# EAGLE design versao3.0 (EAGLE 5.01)
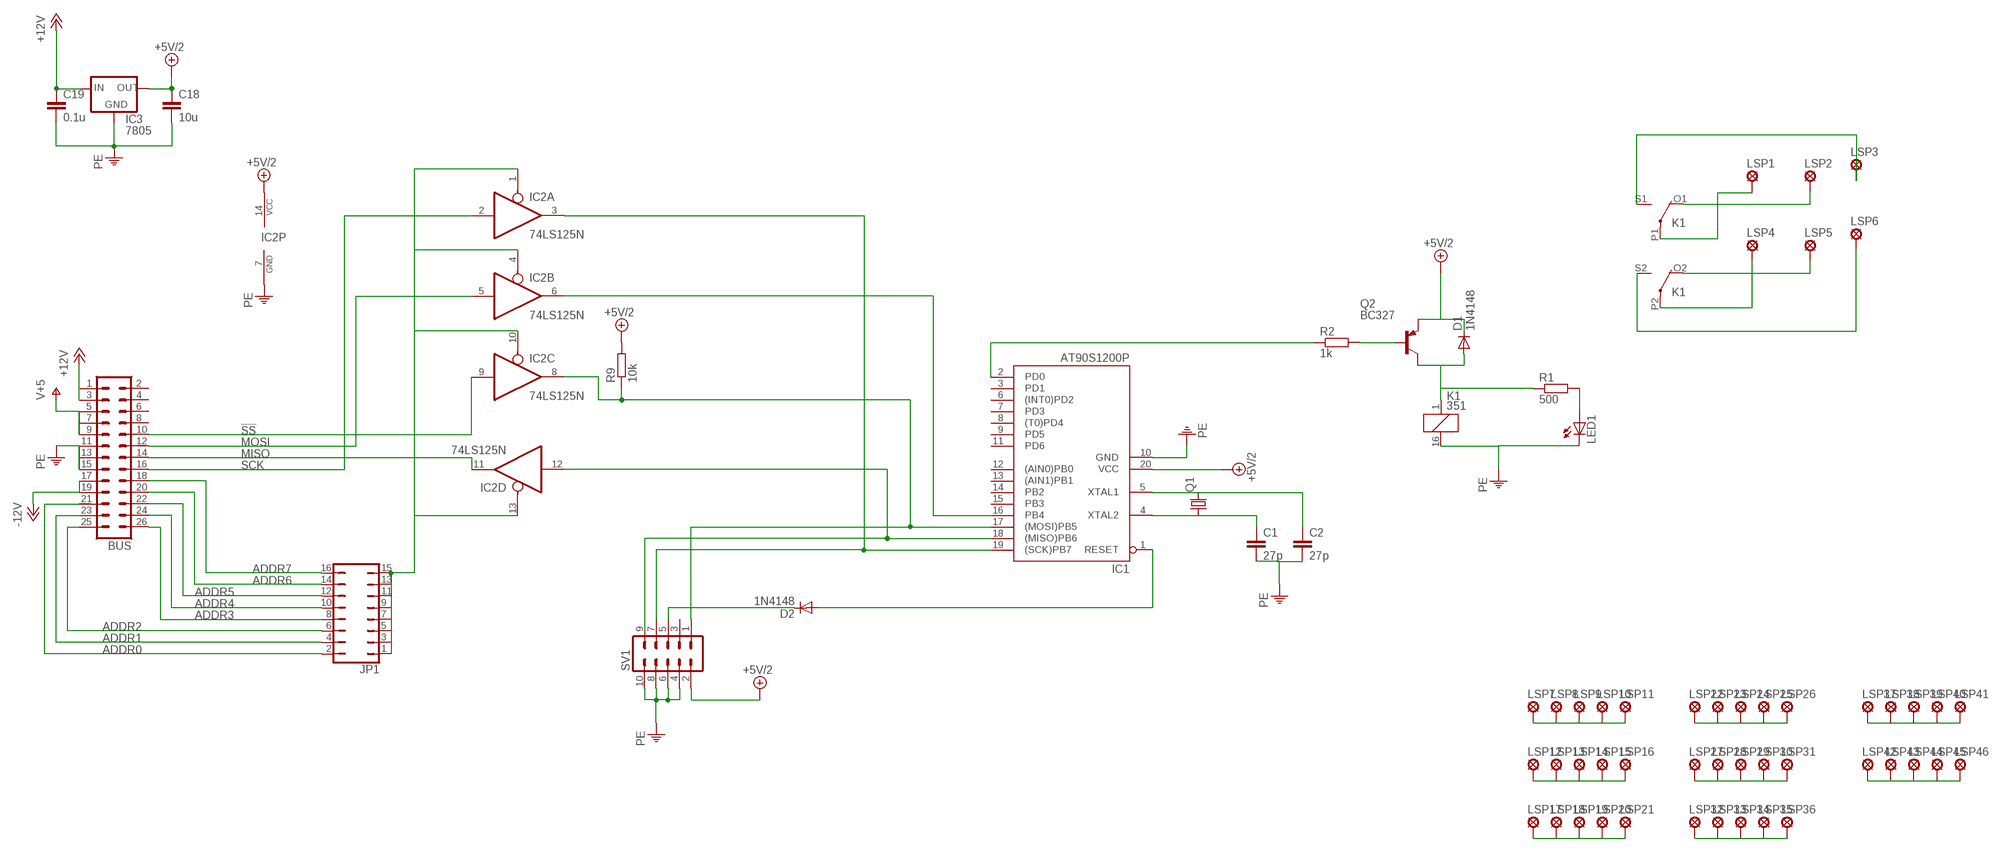
[diagram p0: schematic, sheet 1]

## Parts
BUS  ML26  [ML26]
C1  27p  C5/2.5  [C5B2.5]
C2  27p  C5/2.5  [C5B2.5]
C18  10u  C5/3  [C5B3]
C19  0.1u  C5/3  [C5B3]
D1  1N4148  [DO35-10]
D2  1N4148  [DO35-10]
IC1  AT90S1200P  [DIL20]
IC2  74LS125N  [DIL14]
IC3  7805  78XXL  [78XXL]
JP1  JP8Q  [JP8Q]
K1  351  [351]
LED1  LED3MM  [LED3MM]
LSP1  SE14  [SE14]
LSP2  SE14  [SE14]
LSP3  SE14  [SE14]
LSP4  SE14  [SE14]
LSP5  SE14  [SE14]
LSP6  SE14  [SE14]
LSP7  MCS10B  [MCS10B]
LSP8  MCS10B  [MCS10B]
LSP9  MCS10B  [MCS10B]
LSP10  MCS10B  [MCS10B]
LSP11  MCS10B  [MCS10B]
LSP12  MCS10B  [MCS10B]
LSP13  MCS10B  [MCS10B]
LSP14  MCS10B  [MCS10B]
LSP15  MCS10B  [MCS10B]
LSP16  MCS10B  [MCS10B]
LSP17  MCS10B  [MCS10B]
LSP18  MCS10B  [MCS10B]
LSP19  MCS10B  [MCS10B]
LSP20  MCS10B  [MCS10B]
LSP21  MCS10B  [MCS10B]
LSP22  MCS10B  [MCS10B]
LSP23  MCS10B  [MCS10B]
LSP24  MCS10B  [MCS10B]
LSP25  MCS10B  [MCS10B]
LSP26  MCS10B  [MCS10B]
LSP27  MCS10B  [MCS10B]
LSP28  MCS10B  [MCS10B]
LSP29  MCS10B  [MCS10B]
LSP30  MCS10B  [MCS10B]
LSP31  MCS10B  [MCS10B]
LSP32  MCS10B  [MCS10B]
LSP33  MCS10B  [MCS10B]
LSP34  MCS10B  [MCS10B]
LSP35  MCS10B  [MCS10B]
LSP36  MCS10B  [MCS10B]
LSP37  MCS10B  [MCS10B]
LSP38  MCS10B  [MCS10B]
LSP39  MCS10B  [MCS10B]
LSP40  MCS10B  [MCS10B]
LSP41  MCS10B  [MCS10B]
LSP42  MCS10B  [MCS10B]
LSP43  MCS10B  [MCS10B]
LSP44  MCS10B  [MCS10B]
LSP45  MCS10B  [MCS10B]
LSP46  MCS10B  [MCS10B]
Q1  CRYSTALHC18U-V  [HC18U-V]
Q2  BC327  [TO92-EBC]
R1  500  R-EU_0204/7  [0204/7]
R2  1k  R-EU_0204/7  [0204/7]
R9  10k  R-EU_0204/7  [0204/7]
SV1  ML10  [ML10]

## Nets
!SS: BUS.10 IC2.9(C:I)
+5V/2: C18.1 D1.C IC1.20(VCC) IC2.14(P:VCC) IC3.OUT Q2.E R9.2 SV1.2
+12V: BUS.1 BUS.3 C19.1 IC3.IN
-12V: BUS.17 BUS.19
ADDR0: BUS.21 JP1.2
ADDR1: BUS.23 JP1.4
ADDR2: BUS.25 JP1.6
ADDR3: BUS.26 JP1.8
ADDR4: BUS.24 JP1.10
ADDR5: BUS.22 JP1.12
ADDR6: BUS.20 JP1.14
ADDR7: BUS.18 JP1.16
MISO: BUS.14 IC2.11(D:O)
MOSI: BUS.12 IC2.5(B:I)
N$1: C2.1 IC1.5(XTAL1) Q1.2
N$2: IC1.2(PD0) R2.1
N$3: C1.1 IC1.4(XTAL2) Q1.1
N$4: Q2.B R2.2
N$5: IC1.19((SCK)PB7) IC2.3(A:O) SV1.7
N$6: D1.A K1.1 Q2.C R1.1
N$7: D2.C SV1.5
N$8: LED1.A R1.2
N$9: D2.A IC1.1(RESET)
N$10: K1.P1(2:P) LSP1.MP
N$11: IC1.16(PB4) IC2.6(B:O)
N$12: IC1.18((MISO)PB6) IC2.12(D:I) SV1.9
N$13: IC1.17((MOSI)PB5) IC2.8(C:O) R9.1 SV1.1
N$14: IC2.1(A:OE) IC2.4(B:OE) IC2.10(C:OE) IC2.13(D:OE) JP1.1 JP1.3 JP1.5 JP1.7 JP1.9 JP1.11 JP1.13 JP1.15
N$15: K1.P2(3:P) LSP4.MP
N$16: K1.O1(2:O) LSP2.MP
N$17: K1.O2(3:O) LSP5.MP
N$18: K1.S1(2:S) LSP3.MP
N$19: K1.S2(3:S) LSP6.MP
N$20: LSP7.MP LSP8.MP LSP9.MP LSP10.MP LSP11.MP
N$21: LSP12.MP LSP13.MP LSP14.MP LSP15.MP LSP16.MP
N$22: LSP17.MP LSP18.MP LSP19.MP LSP20.MP LSP21.MP
N$23: LSP22.MP LSP23.MP LSP24.MP LSP25.MP LSP26.MP
N$24: LSP27.MP LSP28.MP LSP29.MP LSP30.MP LSP31.MP
N$25: LSP32.MP LSP33.MP LSP34.MP LSP35.MP LSP36.MP
N$27: LSP37.MP LSP38.MP LSP39.MP LSP40.MP LSP41.MP
N$28: LSP42.MP LSP43.MP LSP44.MP LSP45.MP LSP46.MP
PE: BUS.11 BUS.13 BUS.15 C1.2 C2.2 C18.2 C19.2 IC1.10(GND) IC2.7(P:GND) IC3.GND K1.16 LED1.K(C) SV1.4 SV1.6 SV1.8 SV1.10
SCK: BUS.16 IC2.2(A:I)
V+: BUS.5 BUS.7 BUS.9 ; supply symbol labelled V+5
Unconnected: BUS.2 BUS.4 BUS.6 BUS.8 IC1.3(PD1) IC1.6((INT0)PD2) IC1.7(PD3) IC1.8((T0)PD4) IC1.9(PD5) IC1.11(PD6) IC1.12((AIN0)PB0) IC1.13((AIN1)PB1) IC1.14(PB2) IC1.15(PB3) SV1.3

## Library data of the parts
BUS = con-harting-ml:ML26: HARTING
C1 C2 C18 C19 = capacitor-wima:C: CAPACITOR naming: grid - package width
D1 D2 = diode:1N4148: DIODE high speed (Philips)
IC1 = atmel:AT90S1200: MICROCONTROLLER 1 Kbytes FLASH 64 bytes EEPROM; OC_FARNELL: unknown; OC_NEWARK: unknown
IC2 = 74xx-us:74*125: Quad bus BUFFER, 3-state
IC3 = v-reg:78XXL: VOLTAGE REGULATOR
JP1 = jumper:JP8Q: JUMPER
K1 = relay:351: RELAY 2 x switch, Omron
LED1 = led:LED: LED OSRAM: - CHIPLED LG R971, LG N971, LY N971, LG Q971, LY Q971, LO R971, LY R971 LH N974, LH R974 LS Q976, LO Q976, LY Q976 LO Q996 - Hyper CHIPLED LW Q18S LB Q993, LB Q99A, LB R99A - SideLED LS A670, LO A670, LY A670, LG A670, LP A670 LB A673, LV A673, LT A673, LW A673 LH A674 LY A675 LS A676, LA A676, LO A676, LY A676, LW A676 LS A679, LY A679, LG A679 - Hyper Micro SIDELED® LS Y876, LA Y876, LO Y876, LY Y876 LT Y87S - SmartLED LW L88C, LW L88S LB L89C, LB L89S, LG L890 LS L89K, LO L89K, LY L89K LS L896, LA L896, LO L896, LY L896 - TOPLED LS T670, LO T670, LY T670, LG T670, LP T670 LSG T670, LSP T670, LSY T670, LOP T670, LYG T670 LG T671, LOG T671, LSG T671 LB T673, LV T673, LT T673, LW T673 LH T674 LS T676, LA T676, LO T676, LY T676, LB T676, LH T676, LSB T676, LW T676 LB T67C, LV T67C, LT T67C, LS T67K, LO T67K, LY T67K, LW E67C LS E67B, LA E67B, LO E67B, LY E67B, LB E67C, LV E67C, LT E67C LW T67C LS T679, LY T679, LG T679 LS T770, LO T770, LY T770, LG T770, LP T770 LB T773, LV T773, LT T773, LW T773 LH T774 LS E675, LA E675, LY E675, LS T675 LS T776, LA T776, LO T776, LY T776, LB T776 LHGB T686 LT T68C, LB T68C - Hyper Mini TOPLED® LB M676 - Mini TOPLED Santana® LG M470 LS M47K, LO M47K, LY M47K Source: http://www.osram.convergy.de - LUMILED® LXK2-PW12-R00, LXK2-PW12-S00, LXK2-PW14-U00, LXK2-PW14-V00 LXK2-PM12-R00, LXK2-PM12-S00, LXK2-PM14-U00 LXK2-PE12-Q00, LXK2-PE12-R00, LXK2-PE12-S00, LXK2-PE14-T00, LXK2-PE14-U00 LXK2-PB12-K00, LXK2-PB12-L00, LXK2-PB12-M00, LXK2-PB14-N00, LXK2-PB14-P00, LXK2-PB14-Q00 LXK2-PR12-L00, LXK2-PR12-M00, LXK2-PR14-Q00, LXK2-PR14-R00 LXK2-PD12-Q00, LXK2-PD12-R00, LXK2-PD12-S00 LXK2-PH12-R00, LXK2-PH12-S00 LXK2-PL12-P00, LXK2-PL12-Q00, LXK2-PL12-R00 Source: www.luxeon.com
LSP1-LSP6 = solpad:SE14: SOLDER PAD E1553, drill 1,4mm, distributor Buerklin, 07F820
LSP7-LSP46 = solpad:MCS10B: SOLDER PAD MC S1, distributor Buerklin, 15F505
Q1 = crystal:CRYSTAL: CRYSTAL
Q2 = transistor-pnp:BC327*: PNP Transistror
R1 R2 R9 = resistor:R-EU_: RESISTOR, European symbol
SV1 = con-ml:ML10: HARTING

## Board
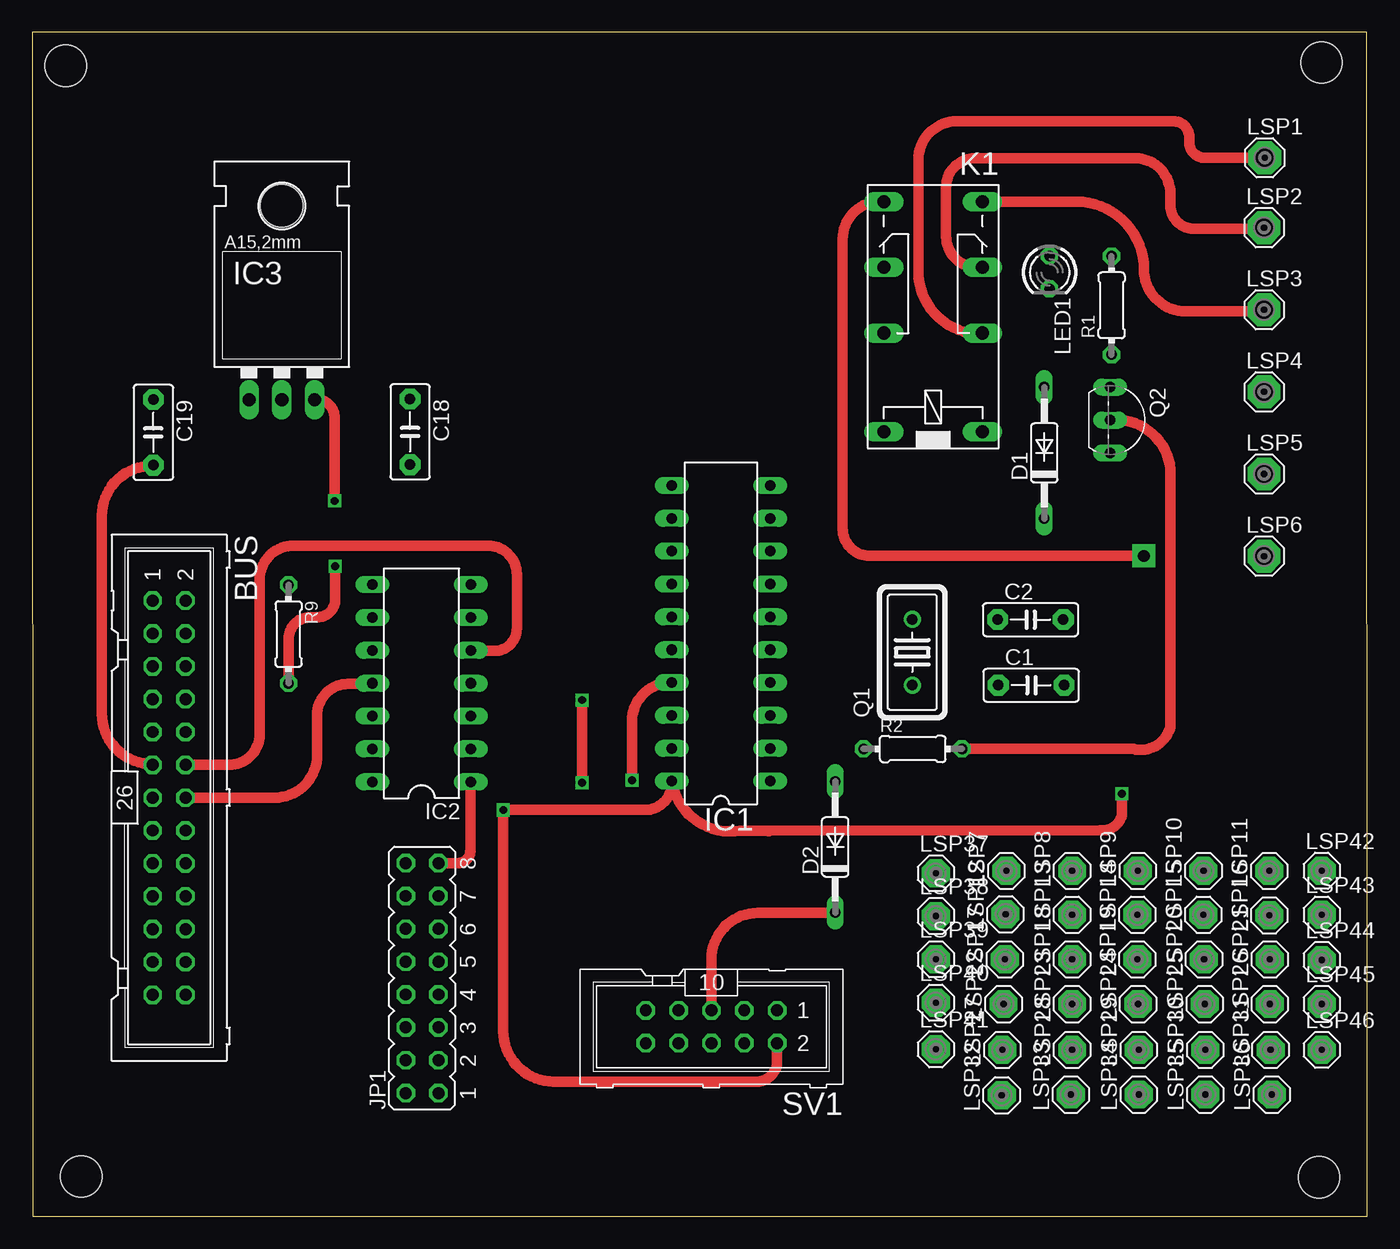
[diagram p1: board, top side]
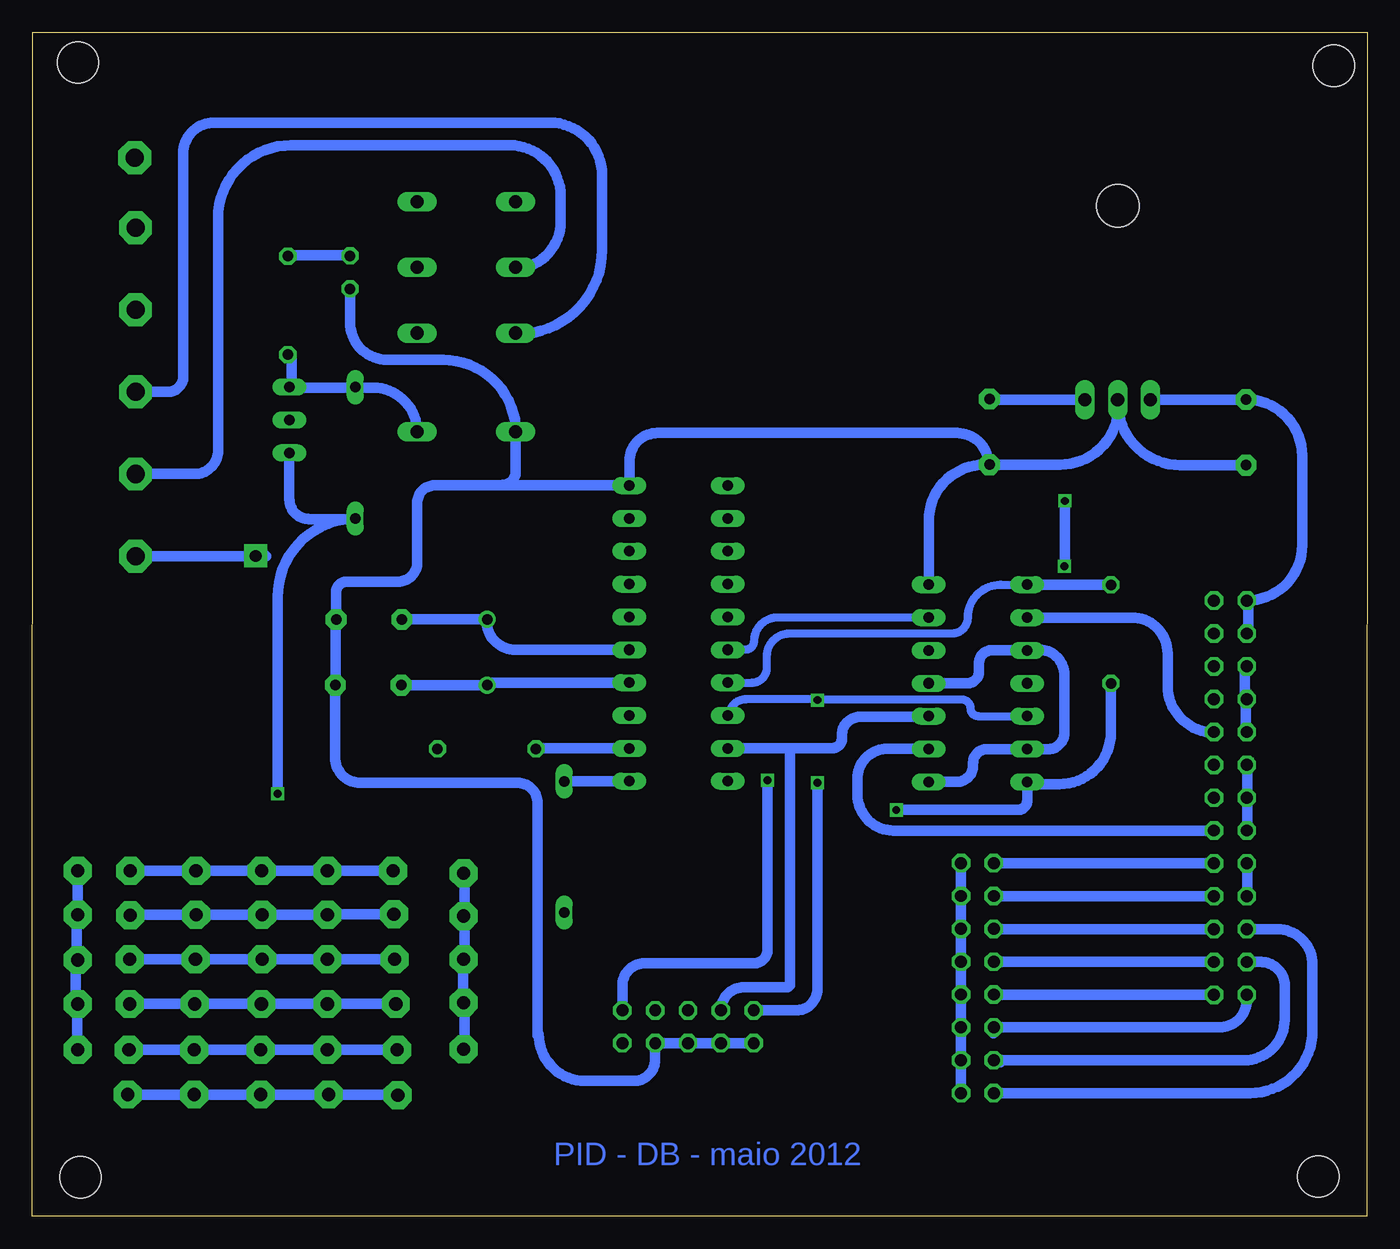
[diagram p2: board, bottom side, seen from below]

Size 103.25 x 91.55 mm. Coordinates in mm from the lower left corner, seen from the top.
Outline: 0.05,0 103.25,0 103.2,91.55 0,91.55 0.05,0
Copper layers (1*16): Top 0.035mm / dielectric 1.5mm / Bottom 0.035mm
Design rules "default": minimum track width 10mil, minimum drill 24mil, track to track 8mil, track to pad 8mil, pad to pad 8mil, via to via 8mil, smd to smd 8mil, copper to edge 40mil, drill to drill 8mil, minimum pad ring 10mil, minimum via ring 8mil, stop-mask expansion 4mil, vias tented up to drill 0mil, thermal gap 10mil
Holes 3.2 mm at 2.58,88.97 3.78,3.07 99.73,89.22 99.53,3.02

### Footprints (pad centres in the part's own frame; a part is rotated, then mirrored left to right if it is on the bottom)
ML26 = drill 0.914 octagon: 1 -15.24,-1.27; 2 -15.24,1.27; 3 -12.7,-1.27; 4 -12.7,1.27; 5 -10.16,-1.27; 6 -10.16,1.27; 7 -7.62,-1.27; 8 -7.62,1.27; 9 -5.08,-1.27; 10 -5.08,1.27; 11 -2.54,-1.27; 12 -2.54,1.27; 13 0,-1.27; 14 0,1.27; 15 2.54,-1.27; 16 2.54,1.27; 17 5.08,-1.27; 18 5.08,1.27; 19 7.62,-1.27; 20 7.62,1.27; 21 10.16,-1.27; 22 10.16,1.27; 23 12.7,-1.27; 24 12.7,1.27; 25 15.24,-1.27; 26 15.24,1.27
C5B2.5 = drill 0.813 pad 1.6 octagon: 1 -2.54,0; 2 2.54,0
C5B3 = drill 0.813 pad 1.6 octagon: 1 -2.54,0; 2 2.54,0
DO35-10 = drill 0.813 long: A 5.08,0; C -5.08,0
DIL20 = drill 0.813 long: 1 -11.43,-3.81; 2 -8.89,-3.81; 3 -6.35,-3.81; 4 -3.81,-3.81; 5 -1.27,-3.81; 6 1.27,-3.81; 7 3.81,-3.81; 8 6.35,-3.81; 9 8.89,-3.81; 10 11.43,-3.81; 11 11.43,3.81; 12 8.89,3.81; 13 6.35,3.81; 14 3.81,3.81; 15 1.27,3.81; 16 -1.27,3.81; 17 -3.81,3.81; 18 -6.35,3.81; 19 -8.89,3.81; 20 -11.43,3.81
DIL14 = drill 0.813 long: 1 -7.62,-3.81; 2 -5.08,-3.81; 3 -2.54,-3.81; 4 0,-3.81; 5 2.54,-3.81; 6 5.08,-3.81; 7 7.62,-3.81; 8 7.62,3.81; 9 5.08,3.81; 10 2.54,3.81; 11 0,3.81; 12 -2.54,3.81; 13 -5.08,3.81; 14 -7.62,3.81
78XXL = drill 1.016 long: GND 0,-3.81; IN -2.54,-3.81; OUT 2.54,-3.81 | hole 3.302: 0,11.176
JP8Q = drill 0.914 octagon: 1 -8.89,-1.27; 2 -8.89,1.27; 3 -6.35,-1.27; 4 -6.35,1.27; 5 -3.81,-1.27; 6 -3.81,1.27; 7 -1.27,-1.27; 8 -1.27,1.27; 9 1.27,-1.27; 10 1.27,1.27; 11 3.81,-1.27; 12 3.81,1.27; 13 6.35,-1.27; 14 6.35,1.27; 15 8.89,-1.27; 16 8.89,1.27
351 = drill 1.016 long: 1 -3.81,-3.81; 16 -3.81,3.81; O1 8.89,-3.81; O2 8.89,3.81; P1 3.81,-3.81; P2 3.81,3.81; S1 13.97,-3.81; S2 13.97,3.81
LED3MM = drill 0.813 octagon: A -1.27,0; K 1.27,0
SE14 = drill 1.397 pad 2.54 octagon: MP 0,0
MCS10B = drill 1.016 pad 2.159 octagon: MP 0,0
HC18U-V = drill 0.813 round: 1 -2.54,0; 2 2.54,0
TO92-EBC = drill 0.813 long: B 0,-1.27; C -2.54,-1.27; E 2.54,-1.27
0204/7 = drill 0.813 octagon: 1 -3.81,0; 2 3.81,0
ML10 = drill 0.914 octagon: 1 -5.08,-1.27; 2 -5.08,1.27; 3 -2.54,-1.27; 4 -2.54,1.27; 5 0,-1.27; 6 0,1.27; 7 2.54,-1.27; 8 2.54,1.27; 9 5.08,-1.27; 10 5.08,1.27

### Placement (x,y rotation side)
BUS  10.58,32.37 270 top
C1  77.26,41.07 0 top
C2  77.21,46.14 0 top
C18  29.22,60.66 270 top
C19  9.36,60.62 270 top
D1  78.28,59.03 90 top
D2  62.11,28.56 90 top
IC1  53.26,45.08 90 top
IC2  30.1,41.22 90 top
IC3  19.3,66.95 0 top
JP1  30.15,18.42 90 top
K1  69.68,64.49 90 top
LED1  78.68,72.99 270 top
LSP1  95.32,81.85 0 top
LSP2  95.27,76.45 0 top
LSP3  95.27,70.1 0 top
LSP4  95.27,63.75 0 top
LSP5  95.27,57.4 0 top
LSP6  95.27,51.05 0 top
LSP7  75.35,26.71 90 top
LSP8  80.43,26.71 90 top
LSP9  85.51,26.71 90 top
LSP10  90.59,26.71 90 top
LSP11  95.67,26.71 90 top
LSP12  75.28,23.37 90 top
LSP13  80.43,23.32 90 top
LSP14  85.48,23.32 90 top
LSP15  90.58,23.32 90 top
LSP16  95.68,23.27 90 top
LSP17  75.23,19.87 90 top
LSP18  80.43,19.87 90 top
LSP19  85.48,19.87 90 top
LSP20  90.63,19.87 90 top
LSP21  95.73,19.87 90 top
LSP22  75.13,16.42 90 top
LSP23  80.43,16.42 90 top
LSP24  85.53,16.42 90 top
LSP25  90.68,16.42 90 top
LSP26  95.73,16.42 90 top
LSP27  75.03,12.87 90 top
LSP28  80.43,12.87 90 top
LSP29  85.58,12.87 90 top
LSP30  90.73,12.87 90 top
LSP31  95.78,12.87 90 top
LSP32  74.98,9.37 90 top
LSP33  80.33,9.42 90 top
LSP34  85.58,9.42 90 top
LSP35  90.73,9.42 90 top
LSP36  95.88,9.42 90 top
LSP37  69.88,26.52 0 top
LSP38  69.88,23.22 0 top
LSP39  69.88,19.87 0 top
LSP40  69.88,16.52 0 top
LSP41  69.88,12.92 0 top
LSP42  99.73,26.72 0 top
LSP43  99.73,23.32 0 top
LSP44  99.73,19.82 0 top
LSP45  99.73,16.42 0 top
LSP46  99.73,12.87 0 top
Q1  68.06,43.62 90 top
Q2  84.64,61.57 270 top
R1  83.48,70.44 90 top
R2  68.1,36.14 0 top
R9  19.82,45.02 270 top
SV1  52.53,14.66 180 top

### Tracks (layer width: path | path; a pad name or v marks a point on that pad's centre or on a via)
!SS
  Bottom 0.813: IC2.9 18.21,46.3 arc90 15.43,43.52 15.43,41.02 arc-90 11.83,37.42 arc90 BUS.10
+5V/2  (via drill 0.6)
  Top 0.813: R9.2 arc90 R9.2 19.83,44.67 arc-90 21.48,46.32 22.03,46.32 arc90 23.43,47.72 v23.43,50.27 | IC3.OUT 21.95,63.14 arc90 21.98,63.17 arc-90 23.38,61.77 v23.38,55.32 | SV1.2 57.61,12 arc-90 56.03,10.42 40.33,10.42 arc-90 36.43,14.32 36.43,31.32 arc-90 36.48,31.37 arc-90 v36.43,31.42 47.38,31.42 arc90 49.48,33.52 arc-90 49.45,33.55 IC1.20 arc90 54.73,29.82 56.88,29.82 arc90 57.03,29.82 82.63,29.87 arc90 84.28,31.12 v84.28,32.67
  Bottom 0.813: C18.1 29.11,63.2 arc90 29.08,63.17 arc-90 29.05,63.14 IC3.OUT | R9.2 19.82,37.43 arc90 23.83,33.42 25.93,33.42 arc90 26.23,33.72 arc-90 26.29,33.66 IC2.14 26.29,32.16 arc90 27.03,31.42 v36.43,31.42 | v23.43,50.27 arc-90 23.38,50.32 v23.38,55.32 | Q2.E 83.37,55.46 arc-90 81.83,53.92 78.48,53.92 arc90 78.43,53.87 arc90 78.35,53.95 D1.C 78.2,53.95 arc-90 78.18,53.97 arc-90 84.28,47.87 v84.28,32.67
+12V
  Bottom 0.813: 9.18,47.61 9.18,47.67 | 9.18,47.61 BUS.1 arc-90 5.03,51.89 5.03,58.82 arc-90 9.38,63.17 arc-90 C19.1 16.59,63.16 arc-90 16.73,63.02 arc90 16.76,63.05 IC3.IN | BUS.3 9.18,45.07 9.18,47.61
-12V
  Bottom 0.813: BUS.17 9.28,27.29 9.28,24.75 BUS.19
ADDR0
  Bottom 0.813: BUS.21 6.97,22.21 arc90 4.23,19.47 4.23,14.37 arc90 9.08,9.52 28.78,9.52 arc-90 28.83,9.47 arc90 JP1.2
ADDR1
  Bottom 0.813: BUS.23 8.23,19.67 arc90 6.38,17.82 6.38,15.22 arc90 9.53,12.07 28.23,12.07 arc-90 28.38,11.92 28.93,11.92 arc-90 28.88,11.97 JP1.4
ADDR2
  Bottom 0.813: BUS.25 9.31,16.74 arc90 11.43,14.62 28.48,14.62 arc-90 28.93,14.17 arc-90 28.88,14.22 JP1.6
ADDR3
  Bottom 0.813: JP1.8 28.8,17.15 arc-90 28.78,17.17 arc-90 28.74,17.13 BUS.26
ADDR4
  Bottom 0.813: JP1.10 28.61,19.69 arc-90 28.53,19.77 arc-90 28.43,19.67 BUS.24
ADDR5
  Bottom 0.813: JP1.12 28.82,22.23 arc-90 28.78,22.27 arc-90 28.72,22.21 BUS.22
ADDR6
  Bottom 0.813: BUS.20 28.86,24.75 arc90 JP1.14
ADDR7
  Bottom 0.813: JP1.16 JP1.16 arc-90 28.85,27.29 BUS.18
MISO
  Top 0.813: BUS.14 18.73,32.37 arc90 22.03,35.67 22.03,38.77 arc-90 24.43,41.17 26.23,41.17 arc90 26.33,41.27 arc90 IC2.11
MOSI
  Top 0.813: BUS.12 15.22,34.91 arc90 17.58,37.27 17.58,49.22 arc-90 20.23,51.87 35.23,51.87 arc-90 37.48,49.62 37.48,45.47 arc-90 35.73,43.72 34.03,43.72 arc-90 33.98,43.77 arc-90 33.97,43.76 IC2.5
N$1
  Bottom 0.813: IC1.5 65.87,43.81 arc90 68.13,46.07 arc-90 68.06,46.14 Q1.2 74.72,46.16 arc90 74.73,46.17 arc-90 74.7,46.14 C2.1
N$2
  Bottom 0.813: R2.1 64.29,36.11 arc90 64.38,36.02 arc90 64.21,36.19 IC1.2
N$3
  Bottom 0.813: IC1.4 67.93,41.27 arc-90 68.08,41.12 arc90 68.06,41.1 Q1.1 67.97,41.08 arc-90 67.93,41.12 arc90 67.98,41.07 C1.1
N$4
  Top 0.813: R2.2 85.15,36.14 arc90 88.03,37.87 88.03,57.77 arc90 Q2.B
N$5
  Bottom 0.813: 44.63,36.19 41.41,36.19 arc-90 40.63,36.97 40.63,37.22 arc90 39.23,38.62 33.83,38.62 arc-90 33.78,38.67 arc-90 33.79,38.68 IC2.3 | 44.63,36.19 IC1.19 | SV1.7 arc90 48.2,17.72 44.93,17.72 arc-90 44.63,18.02 44.63,36.19
N$6
  Bottom 0.813: 78.32,64.07 78.38,64.07 | 78.32,64.07 arc-90 D1.A arc90 78.32,64.07 | K1.1 arc-90 76.88,64.07 78.32,64.07 | 78.32,64.07 83.33,64.07 arc90 Q2.C arc90 Q2.C 83.18,64.12 83.18,66.33 arc-90 R1.1
N$7
  Top 0.813: SV1.5 52.53,19.87 arc-90 56.13,23.47 62.03,23.47 arc-90 62.18,23.32 arc-90 62.11,23.39 D2.C
N$8
  Bottom 0.813: LED1.A arc-90 78.63,74.31 78.63,74.32 83.41,74.32 arc-90 R1.2
N$9
  Bottom 0.813: IC1.1 57.2,33.65 arc-90 57.28,33.57 arc-90 57.35,33.64 D2.A
N$10
  Top 0.813: LSP1.MP 90.7,81.85 arc-90 89.48,83.07 89.48,83.47 arc90 88.28,84.67 71.53,84.67 arc90 68.53,81.67 68.53,73.07 arc90 73.38,68.22 arc-90 73.46,68.3 K1.P1
N$11
  Bottom 0.61: IC2.6 45.6,46.3 arc-90 47.43,44.47 arc90 48.08,43.82 IC1.16 | IC1.16 49.53,43.82 | IC1.16 arc90 IC1.16
N$12  (via drill 0.6)
  Top 0.813: v42.53,33.52 v42.53,39.92
  Bottom 0.61: IC2.12 30.09,38.68 arc90 30.68,39.27 arc-90 31.38,39.97 42.53,39.97 48.08,39.97 arc-90 49.38,38.67 arc-90 IC1.18
  Bottom 0.813: SV1.9 44.17,15.93 arc-90 42.53,17.57 v42.53,33.52 | 42.53,39.97 v42.53,39.92 42.53,39.87
N$13  (via drill 0.6)
  Top 0.813: IC1.17 49.38,41.27 arc90 46.38,38.27 v46.38,33.72
  Bottom 0.61: IC2.8 28.36,48.84 arc-90 30.88,46.32 arc90 32.13,45.07 44.68,45.07 arc-90 46.43,43.32 46.43,42.42 arc90 47.58,41.27 IC1.17 49.48,41.27
  Bottom 0.813: R9.1 19.82,48.78 arc90 19.88,48.72 arc-90 20,48.84 IC2.8 | SV1.1 57.61,17.84 arc90 55.88,19.57 47.43,19.57 arc-90 46.38,20.62 v46.38,33.72
N$14
  Top 0.813: JP1.15 32.92,27.31 arc90 33.88,28.27 33.88,33.42 arc-90 33.98,33.52 arc-90 IC2.1
  Bottom 0.813: IC2.4 30.93,41.22 arc-90 30.03,42.12 30.03,42.77 arc90 29.03,43.77 26.38,43.77 arc90 26.33,43.72 arc-90 IC2.10 arc90 26.23,43.82 25.38,43.82 arc90 23.43,41.87 23.43,37.37 arc90 24.68,36.12 29.43,36.12 | 32.8,33.6 IC2.1 31.75,33.6 arc-90 30.48,34.87 30.48,35.07 arc90 29.43,36.12 | IC2.13 26.31,36.14 arc-90 26.33,36.12 29.43,36.12 | JP1.1 31.42,11.81 arc-90 31.68,12.07 JP1.3 31.42,14.58 arc90 31.38,14.62 arc90 31.39,14.61 JP1.5 31.42,17.03 arc90 31.38,17.07 arc90 31.42,17.11 JP1.7 JP1.9 arc90 31.38,19.72 arc90 JP1.9 31.42,21.98 arc90 31.33,22.07 arc90 31.42,22.16 JP1.11 31.42,24.71 arc-90 31.48,24.77 JP1.13 31.42,27.03 arc90 31.38,27.07 arc90 31.42,27.11 JP1.15
N$15
  Bottom 0.813: LSP4.MP 92.75,63.75 arc-90 91.58,64.92 91.58,82.17 arc90 89.18,84.57 63.23,84.57 arc90 59.18,80.52 59.18,74.72 arc90 65.68,68.22 arc-90 65.76,68.3 K1.P2
N$16
  Top 0.813: K1.O1 73.07,73.38 arc-90 70.68,75.77 70.68,79.57 arc-90 72.93,81.82 85.28,81.82 arc-90 88.03,79.07 88.03,78.17 arc90 89.83,76.37 95.23,76.37 arc90 95.33,76.47 arc-90 95.31,76.45 LSP2.MP
N$17
  Bottom 0.813: LSP5.MP 90.7,57.4 arc-90 88.88,59.22 88.88,77.17 arc90 83.23,82.82 66.33,82.82 arc90 62.38,78.87 62.38,76.92 arc90 66.03,73.27 arc90 65.92,73.38 K1.O2
N$18
  Top 0.813: K1.S1 80.74,78.46 arc-90 85.98,73.22 arc90 89.23,69.97 95.38,69.97 95.38,69.99 arc90 LSP3.MP
N$19  (via drill 0.9 pad 1.78)
  Top 0.813: v85.98,51.07 64.78,51.07 arc-90 62.68,53.17 62.68,75.57 arc-90 65.58,78.47 arc90 65.59,78.46 K1.S2
  Bottom 0.813: LSP6.MP 85.15,51.05 arc-90 v85.98,51.07
N$20
  Bottom 0.813: 80.28,26.71 LSP8.MP LSP9.MP | LSP7.MP 80.28,26.71 | 80.28,26.71 80.28,26.62 | LSP9.MP 86.03,26.71 86.03,26.42 85.38,26.42 85.38,26.71 LSP9.MP | 90.38,26.71 LSP10.MP 95.63,26.71 | LSP9.MP 90.38,26.71 | 90.38,26.71 90.38,26.67 | 95.63,26.71 LSP11.MP | 95.63,26.71 95.63,26.72
N$21
  Bottom 0.813: 80.38,23.32 80.38,23.27 | 80.38,23.32 LSP13.MP 85.38,23.32 | LSP12.MP 80.38,23.37 80.38,23.32 | 85.38,23.32 LSP14.MP 90.48,23.32 | 85.38,23.32 85.38,23.47 | 90.48,23.32 LSP15.MP 95.93,23.32 95.93,23.27 LSP16.MP | 90.48,23.32 90.48,23.27
N$22
  Bottom 0.813: LSP21.MP LSP20.MP LSP19.MP | LSP19.MP 85.28,19.87 85.28,19.72 | 80.38,19.87 LSP18.MP 85.53,19.87 | LSP17.MP 80.38,19.87 | 80.38,19.87 80.38,19.92 | 85.53,19.87 LSP19.MP | 85.53,19.87 85.53,19.82
N$23
  Bottom 0.813: LSP22.MP LSP23.MP | LSP23.MP 80.93,16.42 80.93,16.22 80.23,16.22 80.23,16.42 LSP23.MP | LSP23.MP LSP24.MP | LSP24.MP 85.58,16.42 85.58,16.47 | LSP24.MP LSP25.MP | LSP25.MP 91.08,16.42 91.08,16.72 | 95.63,16.42 LSP26.MP | LSP25.MP 95.63,16.42 | 95.63,16.42 95.63,16.47
N$24
  Bottom 0.813: LSP27.MP LSP28.MP | LSP28.MP 80.53,12.87 80.53,12.92 | LSP28.MP LSP29.MP | LSP29.MP 85.78,12.87 85.78,12.77 | LSP30.MP 90.88,12.87 | LSP29.MP LSP30.MP | 95.93,12.87 LSP31.MP | LSP30.MP 95.93,12.87 | 95.93,12.87 95.93,12.72
N$25
  Bottom 0.813: LSP35.MP LSP36.MP | LSP35.MP 90.73,9.47 | LSP34.MP 85.48,9.42 85.48,9.32 | LSP34.MP LSP35.MP | LSP33.MP 80.28,9.42 80.28,9.32 | LSP33.MP LSP34.MP | LSP32.MP 74.88,9.37 74.88,9.42 LSP33.MP
N$27
  Bottom 0.813: LSP41.MP 69.83,12.92 69.83,16.52 LSP40.MP 69.93,16.52 | LSP37.MP 69.83,26.52 69.83,23.22 | 69.83,19.87 69.83,19.77 | 69.83,19.87 LSP39.MP 69.93,19.87 69.93,16.52 | 69.83,23.22 LSP38.MP | 69.83,19.87 69.83,23.22 | 69.93,16.42 69.93,16.52
N$28
  Bottom 0.813: LSP43.MP 99.73,23.12 | LSP43.MP LSP42.MP | 99.83,19.82 99.83,19.67 | 99.83,19.82 LSP44.MP 99.88,19.82 | LSP43.MP 99.83,23.32 99.83,19.82 | LSP46.MP 99.78,12.87 99.78,16.42 LSP45.MP 99.88,16.42 99.88,19.82 | 99.88,19.92 99.88,19.82
PE  (via drill 0.6)
  Top 0.813: v9.28,34.97 arc-90 5.38,38.87 5.38,54.17 arc-90 9.23,58.02 arc-90 9.29,58.08 C19.2
  Bottom 0.813: BUS.15 9.28,29.83 9.28,32.37 | 9.28,34.91 v9.28,34.97 | 9.28,34.91 BUS.11 | 9.28,32.37 BUS.13 | 9.28,32.37 9.28,34.91 | C19.2 14.44,58.08 arc90 19.28,62.92 arc90 19.3,62.94 IC3.GND 19.3,62.74 arc-90 19.23,62.67 arc90 23.78,58.12 C18.2 29.28,58.12 | 29.28,58.12 29.58,58.12 arc-90 33.91,53.79 IC2.7 | SV1.10 49.85,13.39 arc90 49.88,13.42 arc90 49.91,13.39 SV1.8 52.3,13.39 arc90 52.33,13.42 arc90 52.36,13.39 SV1.6 55.05,13.39 arc90 55.08,13.42 | 55.08,13.42 arc90 55.07,13.41 SV1.4 | 29.28,58.12 arc-90 31.73,60.57 54.88,60.57 arc-90 57.07,58.38 IC1.10 arc-90 57.18,56.62 arc90 57.28,56.52 66.83,56.52 | 66.83,56.52 72.13,56.52 arc-90 73.48,55.17 73.48,50.57 arc90 74.98,49.07 78.93,49.07 arc-90 79.75,48.25 C2.2 79.81,46.14 arc-90 79.83,46.12 arc90 79.8,46.09 C1.2 79.8,41.09 arc-90 79.88,41.17 arc90 79.83,41.12 79.83,35.47 arc-90 77.88,33.52 65.73,33.52 arc90 64.18,31.97 64.18,14.07 arc-90 64.08,13.97 64.08,14.07 arc-90 60.48,10.47 56.73,10.47 arc-90 55.08,12.12 55.08,13.42 | 66.83,56.52 66.83,56.57 arc-90 65.87,57.53 K1.16 65.87,60.61 arc-90 65.83,60.57 arc-90 71.48,66.22 75.78,66.22 arc90 78.68,69.12 LED1.K
SCK
  Bottom 0.813: BUS.16 36.64,29.83 arc90 39.43,32.62 39.43,33.82 arc90 37.08,36.17 33.83,36.17 arc-90 33.73,36.27 arc90 33.86,36.14 IC2.2
V+
  Bottom 0.813: 9.38,39.99 9.38,40.07 | 9.38,39.99 BUS.7 9.48,39.99 9.48,42.53 BUS.5 | BUS.9 9.38,37.45 9.38,39.99

### Text on the board
Bottom: PID - DB - maio 2012